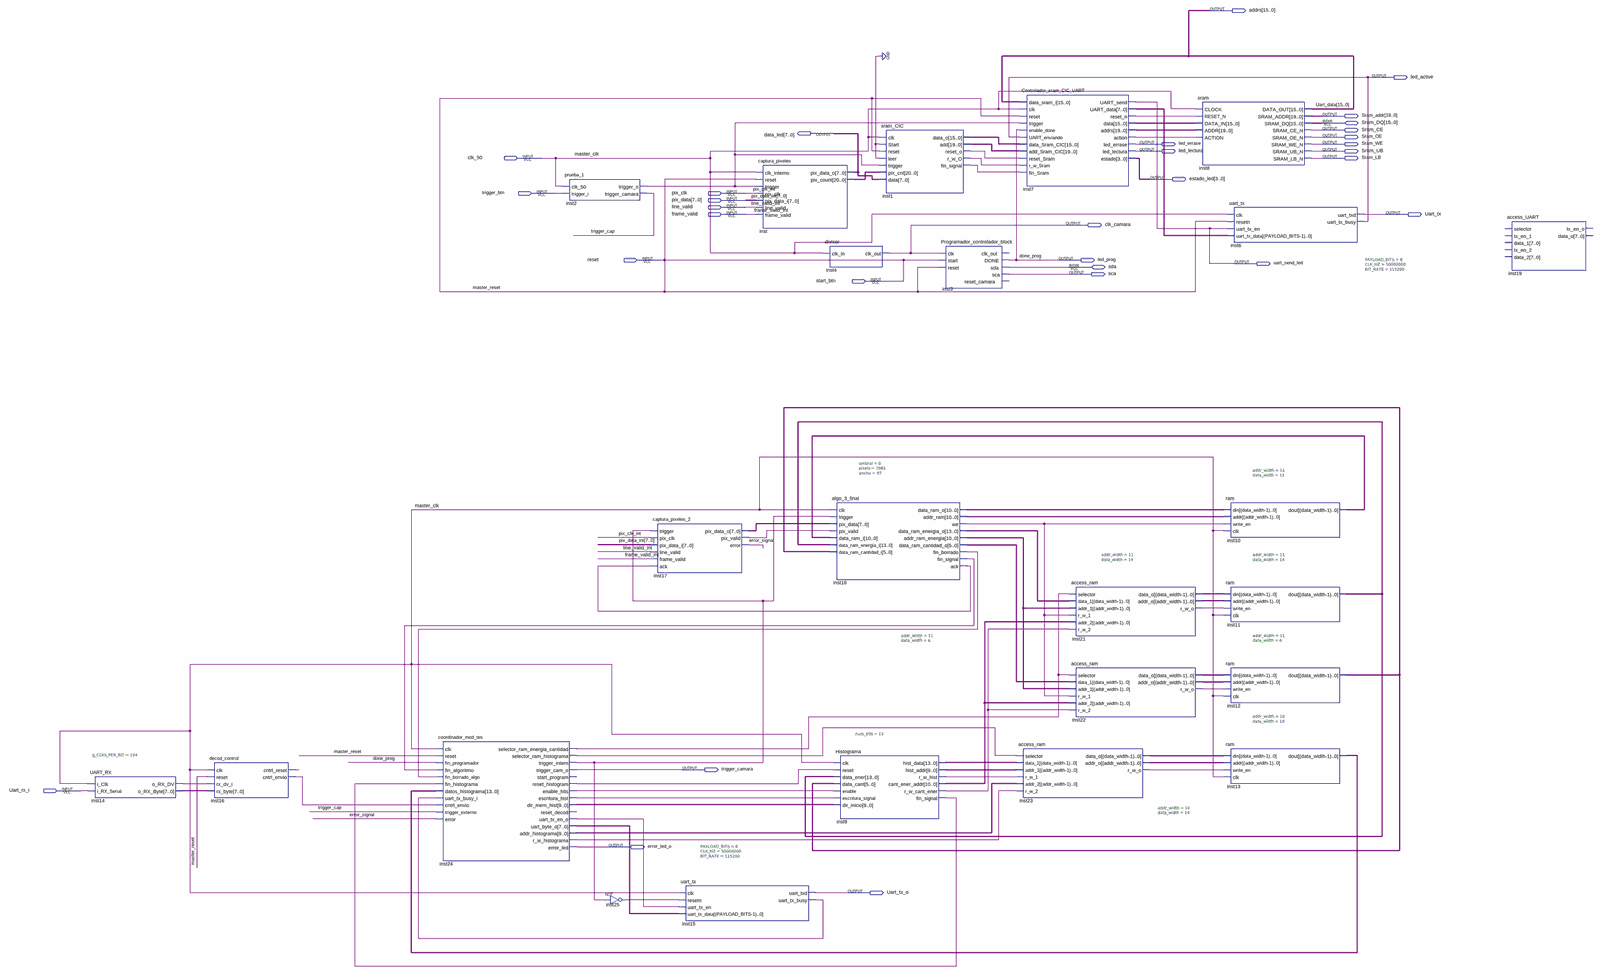
[diagram p0: schematic sheet, whole]
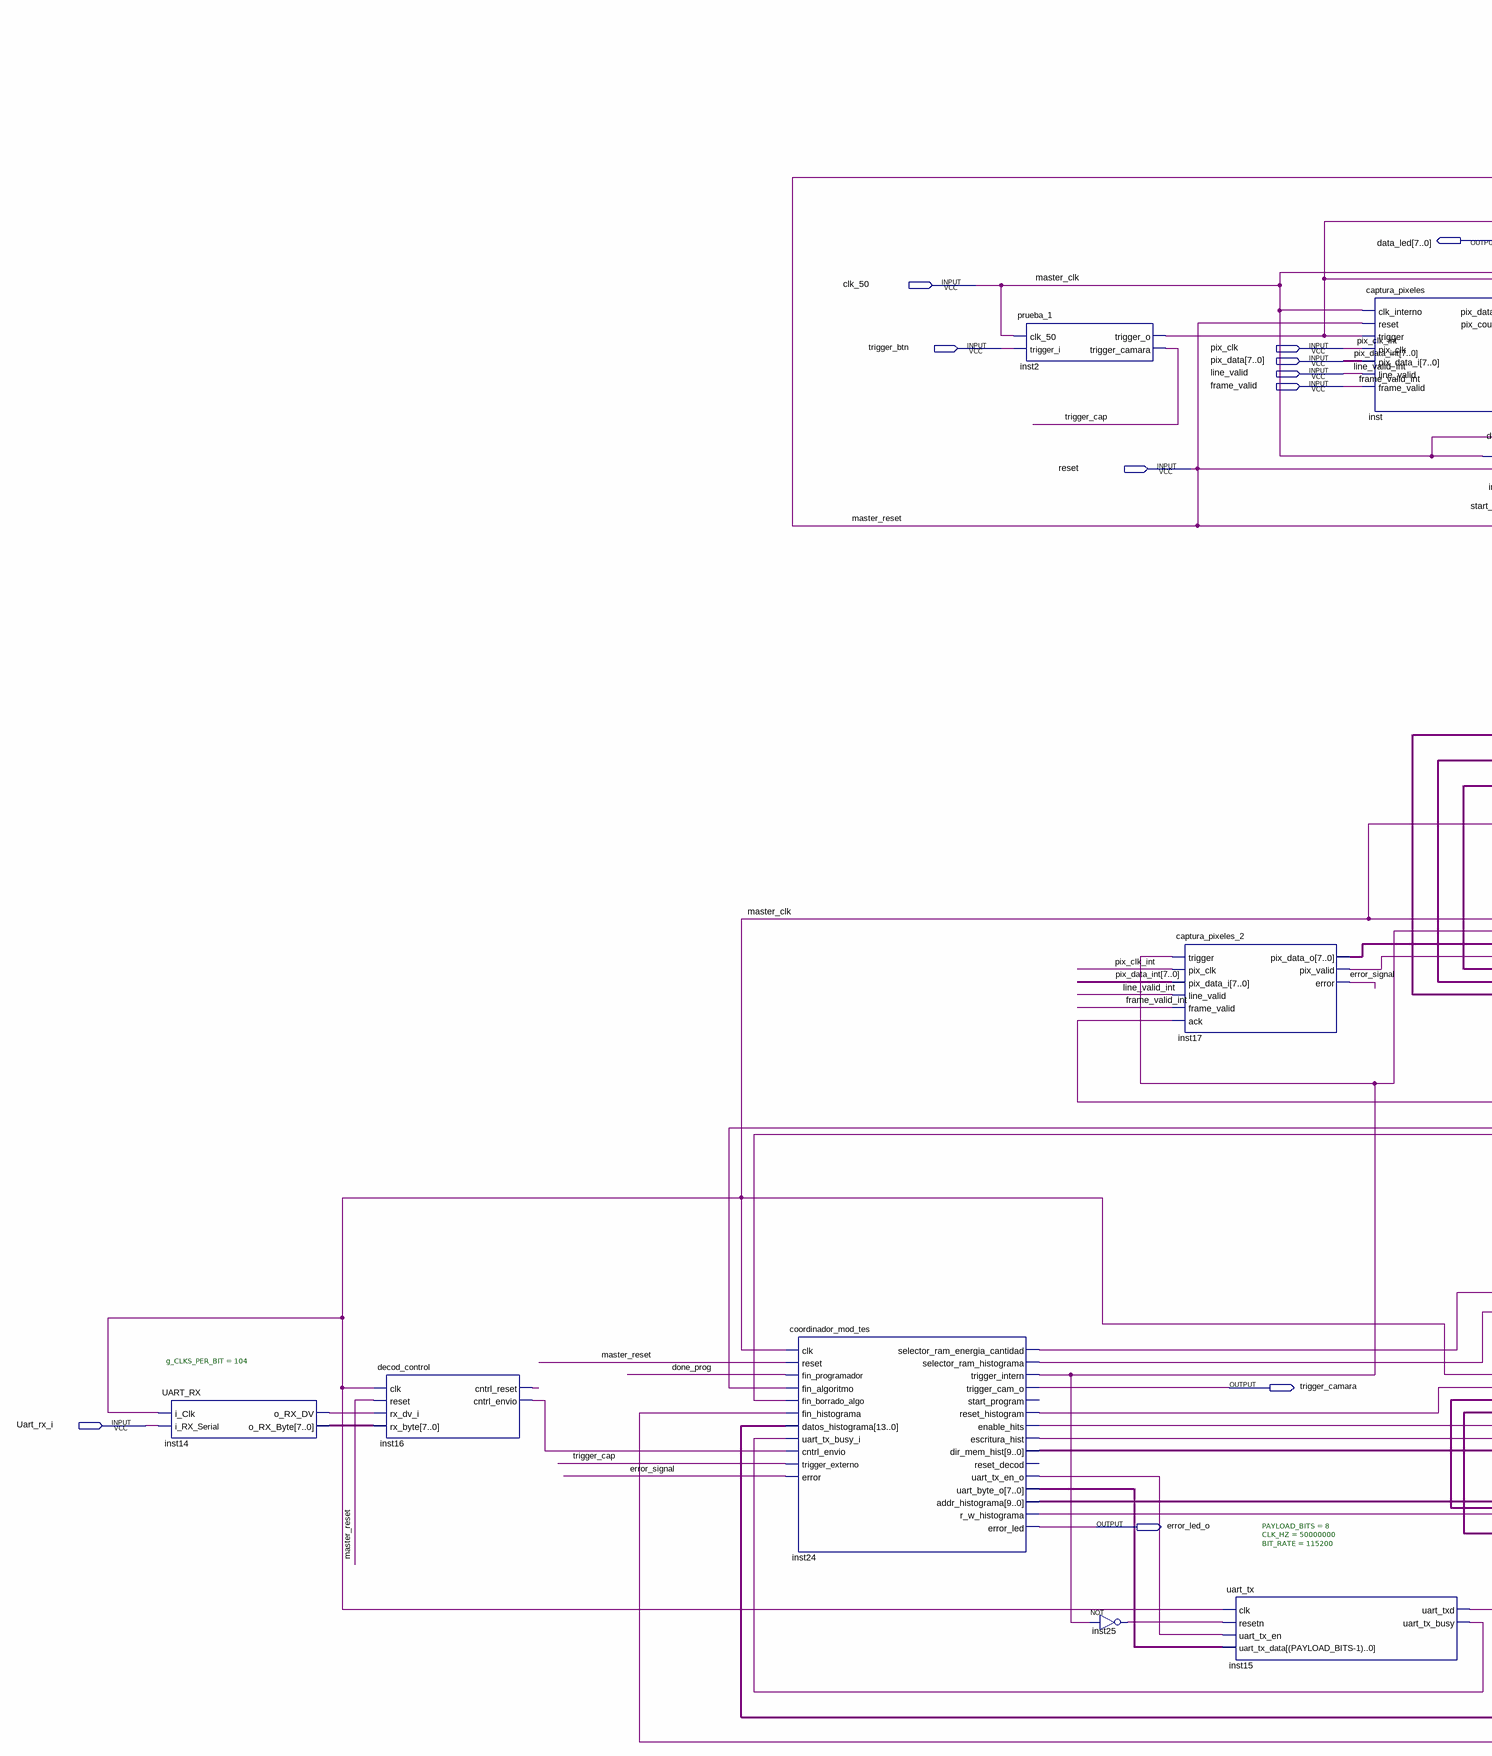
[diagram p1: schematic sheet, left part]
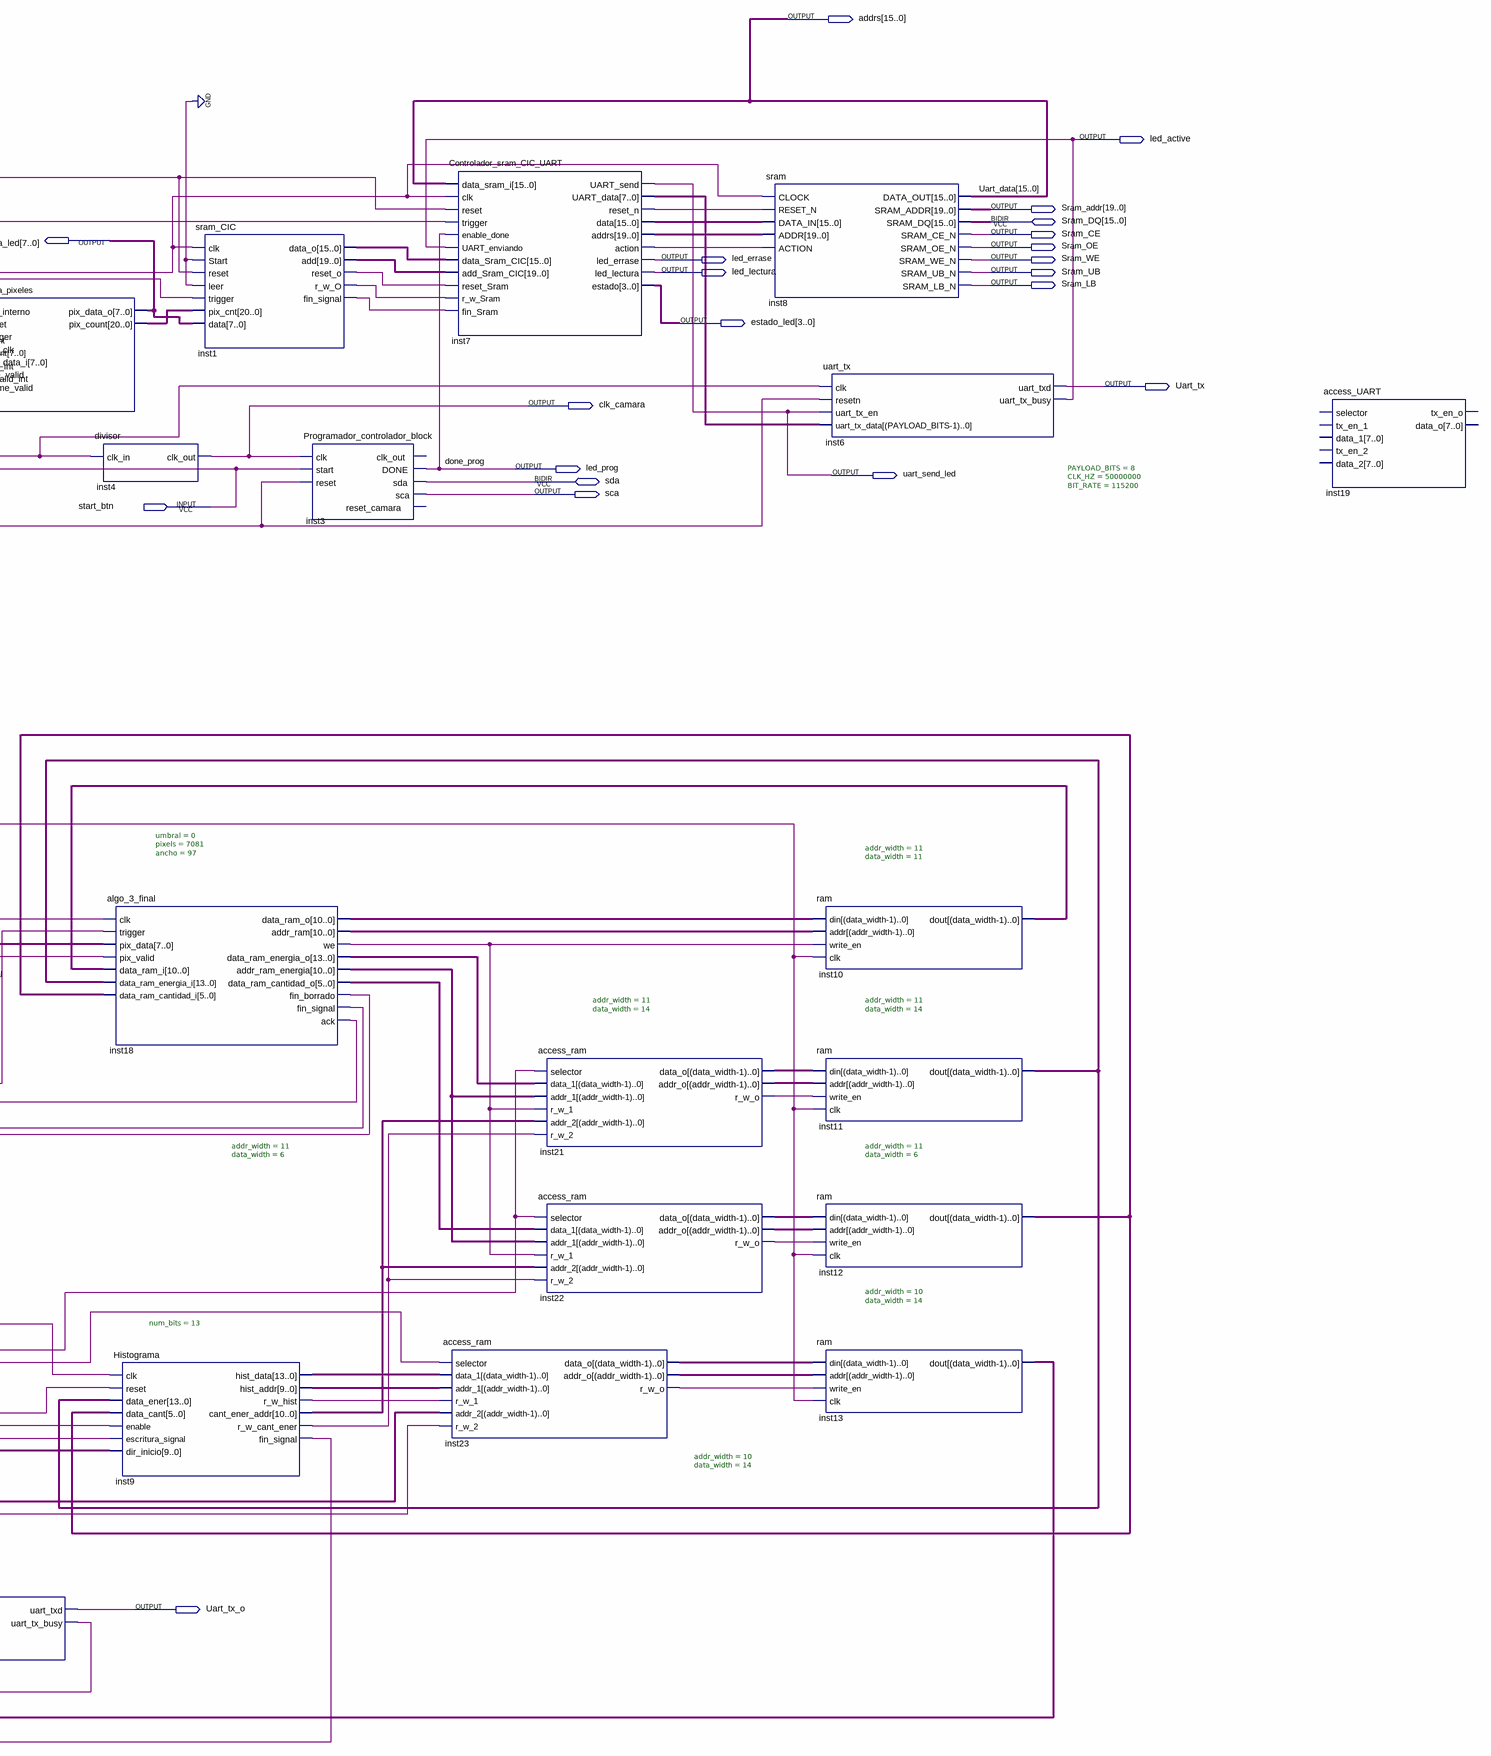
[diagram p2: schematic sheet, right part]
// Quartus schematic sram_cic_v2_2.bdf as structural Verilog: 24 symbols, 31 pins
module sram_cic_v2_2 (
  input  clk_50,
  input  trigger_btn,
  input  pix_clk,
  input  [7:0] pix_data,
  input  line_valid,
  input  frame_valid,
  input  reset,
  input  start_btn,
  input  Uart_rx_i,
  inout  [15:0] Sram_DQ,
  inout  sda,
  output [15:0] addrs,
  output led_active,
  output [19:0] Sram_addr,
  output Sram_CE,
  output [7:0] data_led,
  output Sram_OE,
  output led_errase,
  output Sram_WE,
  output led_lectura,
  output Sram_UB,
  output Sram_LB,
  output [3:0] estado_led,
  output Uart_tx,
  output clk_camara,
  output led_prog,
  output uart_send_led,
  output sca,
  output trigger_camara,
  output error_led_o,
  output Uart_tx_o
);

  wire error_signal, inst1_fin_signal, inst1_r_w_o, inst1_reset_o, inst2_trigger_o, inst7_action,
       inst7_reset_n, inst9_fin_signal, inst9_r_w_cant_ener, inst9_r_w_hist, inst14_o_rx_dv,
       inst15_uart_tx_busy, inst16_cntrl_envio, inst16_cntrl_reset, inst17_pix_valid, inst18_ack,
       inst18_fin_borrado, inst18_fin_signal, inst18_we, inst21_r_w_o, inst22_r_w_o, inst23_r_w_o,
       inst24_enable_hits, inst24_escritura_hist, inst24_r_w_histograma, inst24_reset_histogram,
       inst24_selector_ram_energia_cantidad, inst24_selector_ram_histograma, inst24_trigger_intern,
       inst24_uart_tx_en_o, inst25_out, trigger_cap;
  wire [5:0] inst12_dout, inst18_data_ram_cantidad_o, inst22_data_o;
  wire [7:0] inst7_uart_data, inst14_o_rx_byte, inst17_pix_data_o, inst24_uart_byte_o;
  wire [9:0] inst9_hist_addr, inst23_addr_o, inst24_addr_histograma, inst24_dir_mem_hist;
  wire [10:0] inst9_cant_ener_addr, inst10_dout, inst18_addr_ram, inst18_addr_ram_energia, inst18_data_ram_o,
       inst21_addr_o, inst22_addr_o;
  wire [13:0] inst9_hist_data, inst11_dout, inst13_dout, inst18_data_ram_energia_o, inst21_data_o,
       inst23_data_o;
  wire [15:0] inst1_data_o, inst7_data;
  wire [19:0] inst1_add, inst7_addrs;
  wire [20:0] inst_pix_count;

  UART_RX #(.g_CLKS_PER_BIT(104)) inst14 (
    .i_Clk(clk_50), .i_RX_Serial(Uart_rx_i), .o_RX_DV(inst14_o_rx_dv), .o_RX_Byte(inst14_o_rx_byte));
  decod_control inst16 (
    .clk(clk_50), .reset(reset), .rx_dv_i(inst14_o_rx_dv), .rx_byte(inst14_o_rx_byte),
    .cntrl_reset(inst16_cntrl_reset), .cntrl_envio(inst16_cntrl_envio));
  coordinador_mod_tes inst24 (
    .clk(clk_50), .reset(reset), .fin_programador(led_prog), .fin_algoritmo(inst18_fin_signal),
    .fin_borrado_algo(inst18_fin_borrado), .fin_histograma(inst9_fin_signal), .datos_histograma(inst13_dout),
    .uart_tx_busy_i(inst15_uart_tx_busy), .cntrl_envio(inst16_cntrl_envio), .trigger_externo(trigger_cap),
    .error(error_signal), .selector_ram_energia_cantidad(inst24_selector_ram_energia_cantidad),
    .selector_ram_histograma(inst24_selector_ram_histograma), .trigger_intern(inst24_trigger_intern),
    .trigger_cam_o(trigger_camara), .reset_histogram(inst24_reset_histogram),
    .enable_hits(inst24_enable_hits), .escritura_hist(inst24_escritura_hist),
    .dir_mem_hist(inst24_dir_mem_hist), .uart_tx_en_o(inst24_uart_tx_en_o), .uart_byte_o(inst24_uart_byte_o),
    .addr_histograma(inst24_addr_histograma), .r_w_histograma(inst24_r_w_histograma), .error_led(error_led_o));  // open: start_program, reset_decod
  prueba_1 inst2 (.clk_50(clk_50), .trigger_i(trigger_btn), .trigger_o(inst2_trigger_o), .trigger_camara(trigger_cap));
  not inst25 (inst25_out, inst24_trigger_intern);
  captura_pixeles_2 inst17 (
    .trigger(inst24_trigger_intern), .pix_clk(pix_clk), .pix_data_i(pix_data), .line_valid(line_valid),
    .frame_valid(frame_valid), .ack(inst18_ack), .pix_data_o(inst17_pix_data_o),
    .pix_valid(inst17_pix_valid), .error(error_signal));
  uart_tx #(.PAYLOAD_BITS(8), .CLK_HZ(50000000), .BIT_RATE(115200)) inst15 (
    .clk(clk_50), .resetn(inst25_out), .uart_tx_en(inst24_uart_tx_en_o), .uart_tx_data(inst24_uart_byte_o),
    .uart_txd(Uart_tx_o), .uart_tx_busy(inst15_uart_tx_busy));
  captura_pixeles inst (
    .clk_interno(clk_50), .reset(reset), .trigger(inst2_trigger_o), .pix_clk(pix_clk), .pix_data_i(pix_data),
    .line_valid(line_valid), .frame_valid(frame_valid), .pix_data_o(data_led), .pix_count(inst_pix_count));
  divisor inst4 (.clk_in(clk_50), .clk_out(clk_camara));
  algo_3_final #(.umbral(0), .pixels(7081), .ancho(97)) inst18 (
    .clk(clk_50), .trigger(inst24_trigger_intern), .pix_data(inst17_pix_data_o),
    .pix_valid(inst17_pix_valid), .data_ram_i(inst10_dout), .data_ram_energia_i(inst11_dout),
    .data_ram_cantidad_i(inst12_dout), .data_ram_o(inst18_data_ram_o), .addr_ram(inst18_addr_ram),
    .we(inst18_we), .data_ram_energia_o(inst18_data_ram_energia_o),
    .addr_ram_energia(inst18_addr_ram_energia), .data_ram_cantidad_o(inst18_data_ram_cantidad_o),
    .fin_borrado(inst18_fin_borrado), .fin_signal(inst18_fin_signal), .ack(inst18_ack));
  Histograma #(.num_bits(13)) inst9 (
    .clk(clk_50), .reset(inst24_reset_histogram), .data_ener(inst11_dout), .data_cant(inst12_dout),
    .enable(inst24_enable_hits), .escritura_signal(inst24_escritura_hist), .dir_inicio(inst24_dir_mem_hist),
    .hist_data(inst9_hist_data), .hist_addr(inst9_hist_addr), .r_w_hist(inst9_r_w_hist),
    .cant_ener_addr(inst9_cant_ener_addr), .r_w_cant_ener(inst9_r_w_cant_ener), .fin_signal(inst9_fin_signal));
  sram_CIC inst1 (
    .clk(clk_50), .Start(1'b0), .reset(reset), .leer(1'b0), .trigger(inst2_trigger_o),
    .pix_cnt(inst_pix_count), .data(data_led), .data_o(inst1_data_o), .add(inst1_add),
    .reset_o(inst1_reset_o), .r_w_O(inst1_r_w_o), .fin_signal(inst1_fin_signal));
  Programador_controlador_block inst3 (
    .clk(clk_camara), .start(reset), .reset(reset), .DONE(led_prog), .sca(sca), .sda(sda));  // open: clk_out, reset_camara
  Controlador_sram_CIC_UART inst7 (
    .data_sram_i(addrs), .clk(clk_50), .reset(reset), .trigger(inst2_trigger_o), .enable_done(led_prog),
    .UART_enviando(led_active), .data_Sram_CIC(inst1_data_o), .add_Sram_CIC(inst1_add),
    .reset_Sram(inst1_reset_o), .r_w_Sram(inst1_r_w_o), .fin_Sram(inst1_fin_signal),
    .UART_send(uart_send_led), .UART_data(inst7_uart_data), .reset_n(inst7_reset_n), .data(inst7_data),
    .addrs(inst7_addrs), .action(inst7_action), .led_errase(led_errase), .led_lectura(led_lectura),
    .estado(estado_led));
  access_ram #(.addr_width(10), .data_width(14)) inst23 (
    .selector(inst24_selector_ram_histograma), .data_1(inst9_hist_data), .addr_1(inst9_hist_addr),
    .r_w_1(inst9_r_w_hist), .addr_2(inst24_addr_histograma), .r_w_2(inst24_r_w_histograma),
    .data_o(inst23_data_o), .addr_o(inst23_addr_o), .r_w_o(inst23_r_w_o));
  access_ram #(.addr_width(11), .data_width(14)) inst21 (
    .selector(inst24_selector_ram_energia_cantidad), .data_1(inst18_data_ram_energia_o),
    .addr_1(inst18_addr_ram_energia), .r_w_1(inst18_we), .addr_2(inst9_cant_ener_addr),
    .r_w_2(inst9_r_w_cant_ener), .data_o(inst21_data_o), .addr_o(inst21_addr_o), .r_w_o(inst21_r_w_o));
  access_ram #(.addr_width(11), .data_width(6)) inst22 (
    .selector(inst24_selector_ram_energia_cantidad), .data_1(inst18_data_ram_cantidad_o),
    .addr_1(inst18_addr_ram_energia), .r_w_1(inst18_we), .addr_2(inst9_cant_ener_addr),
    .r_w_2(inst9_r_w_cant_ener), .data_o(inst22_data_o), .addr_o(inst22_addr_o), .r_w_o(inst22_r_w_o));
  sram inst8 (
    .CLOCK(clk_50), .RESET_N(inst7_reset_n), .DATA_IN(inst7_data), .ADDR(inst7_addrs), .ACTION(inst7_action),
    .DATA_OUT(addrs), .SRAM_ADDR(Sram_addr), .SRAM_CE_N(Sram_CE), .SRAM_OE_N(Sram_OE), .SRAM_WE_N(Sram_WE),
    .SRAM_UB_N(Sram_UB), .SRAM_LB_N(Sram_LB), .SRAM_DQ(Sram_DQ));
  uart_tx #(.PAYLOAD_BITS(8), .CLK_HZ(50000000), .BIT_RATE(115200)) inst6 (
    .clk(clk_50), .resetn(reset), .uart_tx_en(uart_send_led), .uart_tx_data(inst7_uart_data),
    .uart_txd(Uart_tx), .uart_tx_busy(led_active));
  ram #(.addr_width(11), .data_width(11)) inst10 (
    .din(inst18_data_ram_o), .addr(inst18_addr_ram), .write_en(inst18_we), .clk(clk_50), .dout(inst10_dout));
  ram #(.addr_width(11), .data_width(14)) inst11 (
    .din(inst21_data_o), .addr(inst21_addr_o), .write_en(inst21_r_w_o), .clk(clk_50), .dout(inst11_dout));
  ram #(.addr_width(11), .data_width(6)) inst12 (
    .din(inst22_data_o), .addr(inst22_addr_o), .write_en(inst22_r_w_o), .clk(clk_50), .dout(inst12_dout));
  ram #(.addr_width(10), .data_width(14)) inst13 (
    .din(inst23_data_o), .addr(inst23_addr_o), .write_en(inst23_r_w_o), .clk(clk_50), .dout(inst13_dout));
  access_UART inst19 ();  // open: selector, tx_en_1, data_1, tx_en_2, data_2, tx_en_o, data_o

  assign start_btn = reset;

  // Other names for the same wires on the sheet: Uart_data[15:0] = addrs; master_clk = clk_50; done_prog = led_prog;
  //   frame_valid_int = frame_valid; line_valid_int = line_valid; pix_clk_int = pix_clk; pix_data_int[7:0] = pix_data;
  //   master_reset = reset
endmodule
